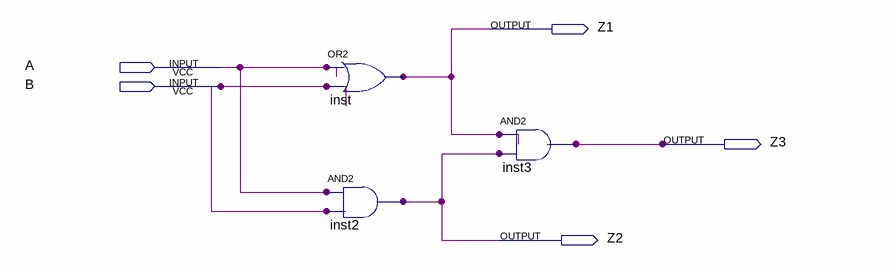
[diagram p0: schematic sheet]
// Quartus schematic Lab1.bdf as structural Verilog: 3 symbols, 5 pins
module Lab1 (
  input  A,
  input  B,
  output Z1,
  output Z3,
  output Z2
);

  or inst (Z1, A, B);
  and inst2 (Z2, A, B);
  and inst3 (Z3, Z1, Z2);
endmodule
